# EasyEDA schematic schematic.json
TITLE: Sheet_1; REV: 1.0; Date: 2024-11-02; Sheet: 1/1; Drawn By: swayamsa01; Company: Your Company
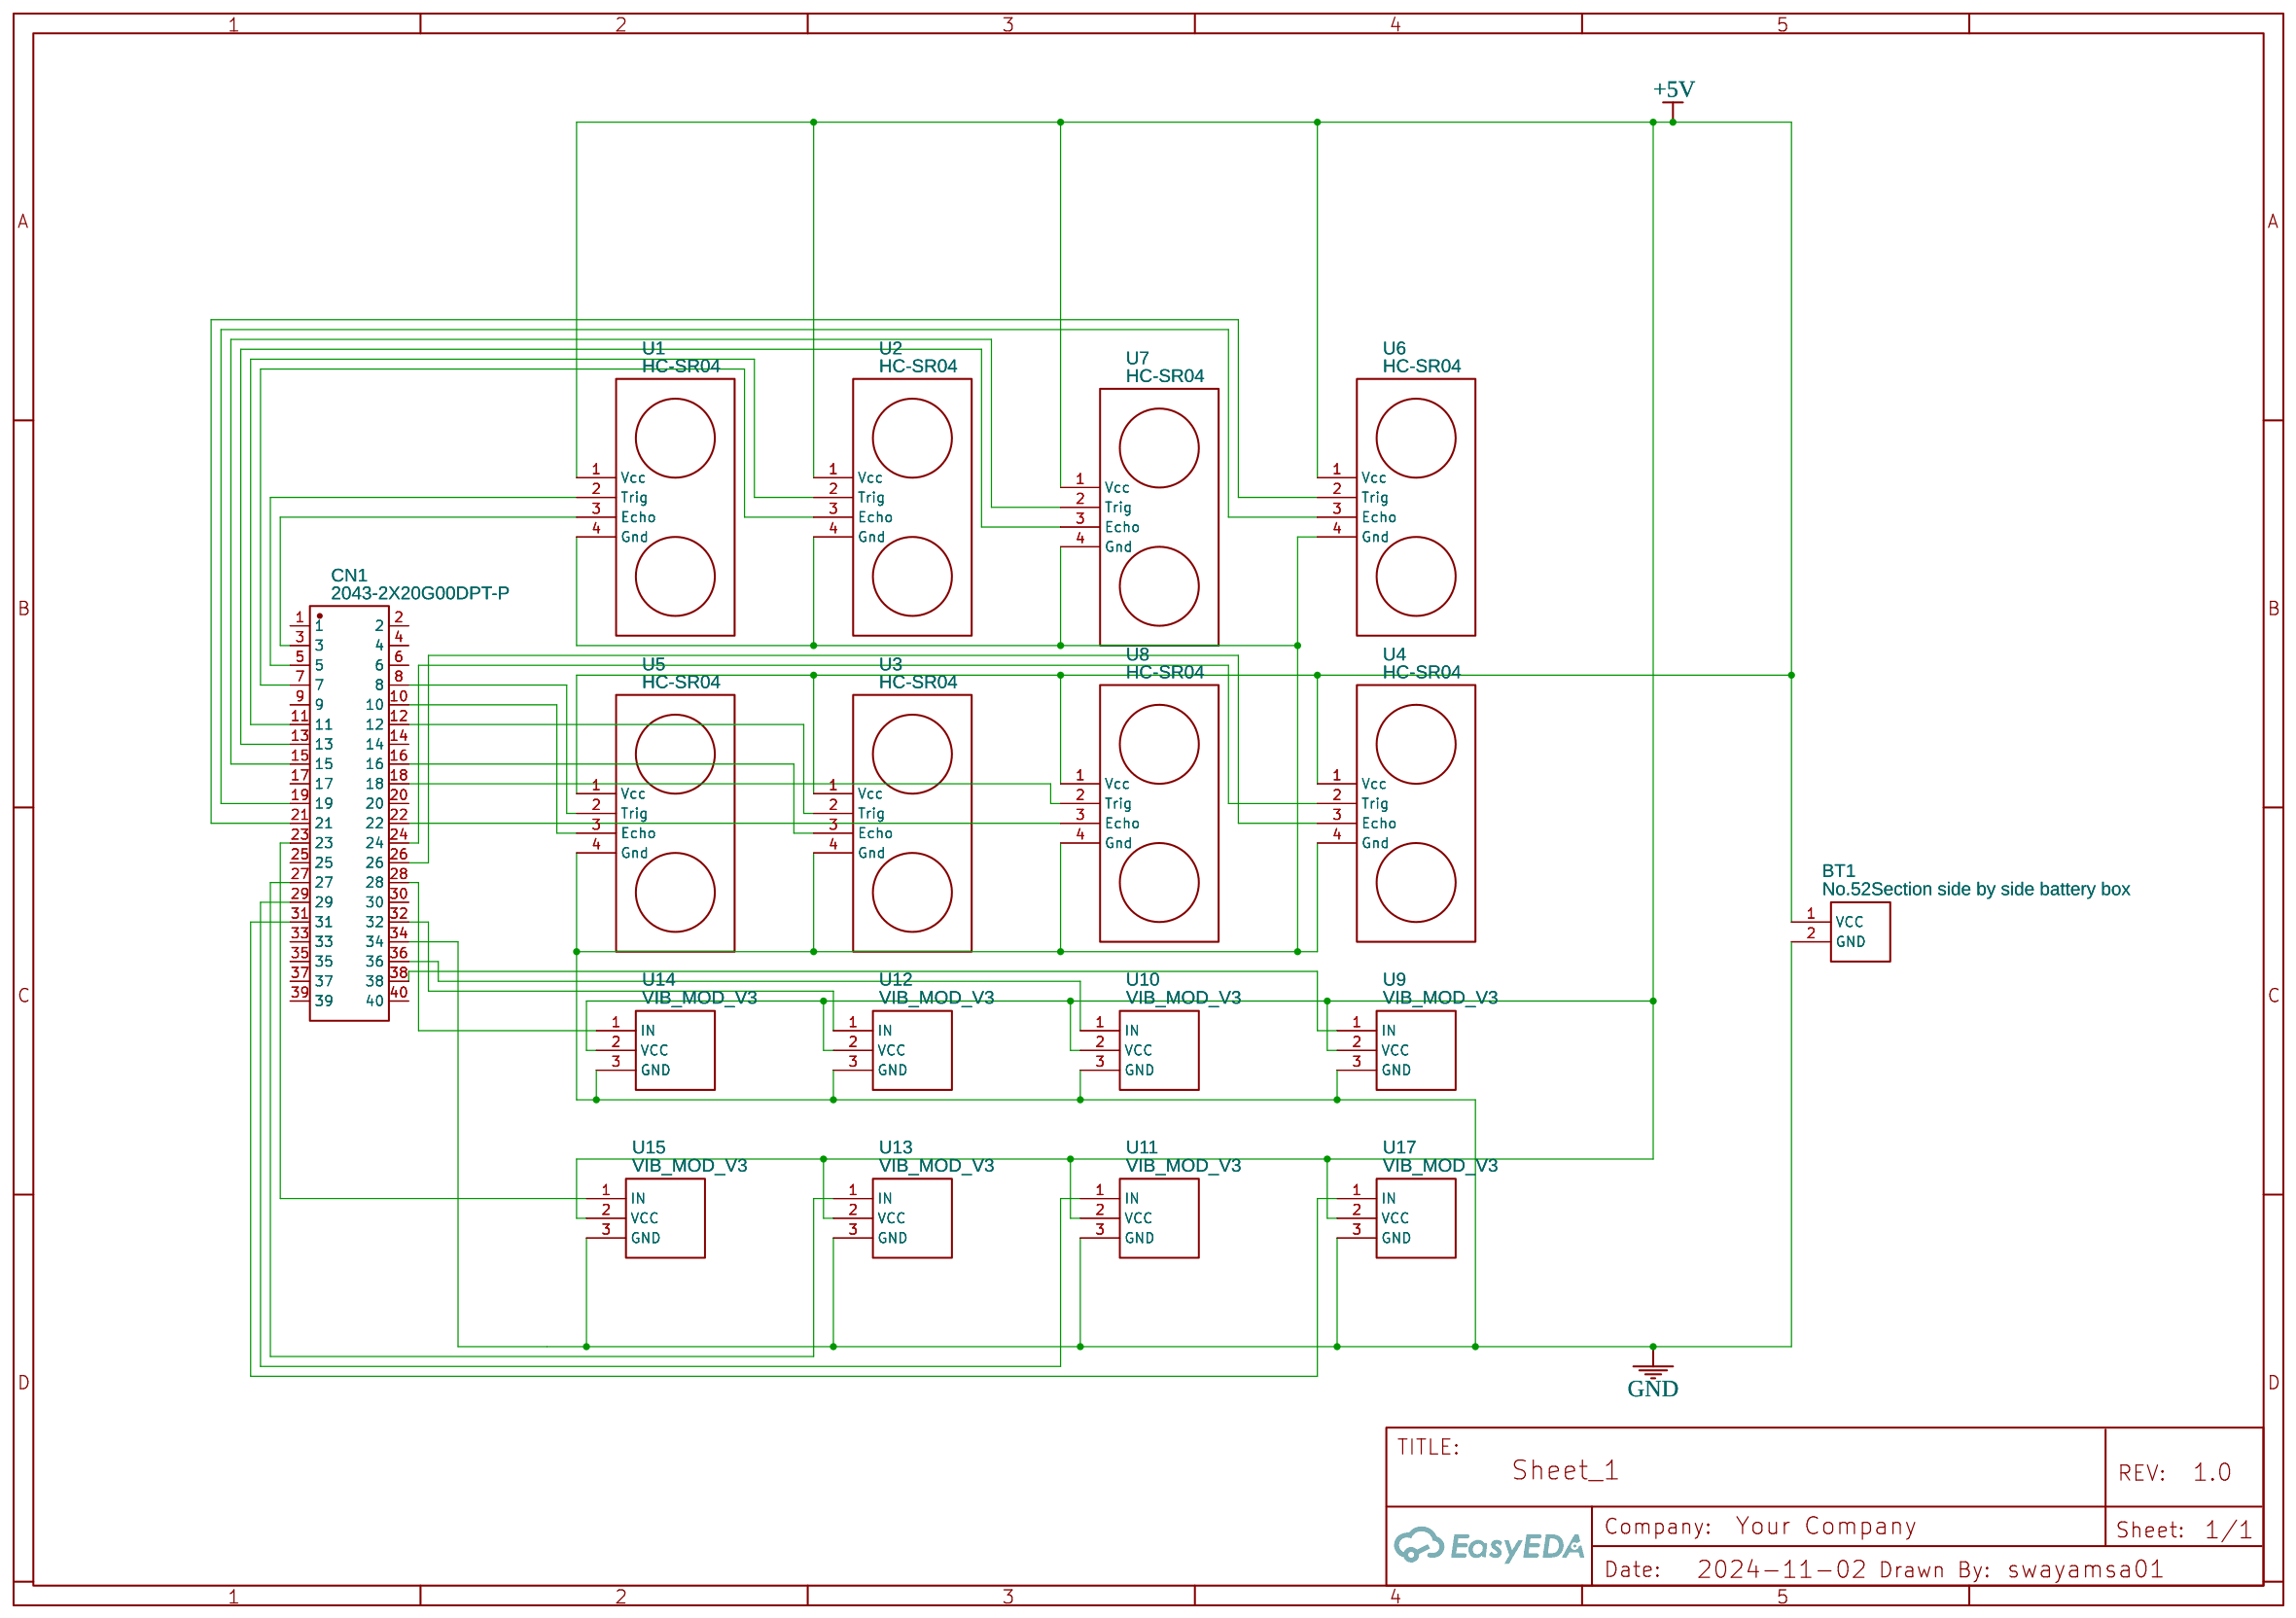
[diagram p0: schematic sheet]

## Parts
BT1  No.52Section side by side battery box  [BAT-TH_BC2AA]
CN1  2043-2X20G00DPT-P  [HDR-SMD_40P-P2.54-V-F-R2-C20-S6.6-EH]
U1  HC-SR04  [HCSR04]
U2  HC-SR04  [HCSR04]
U3  HC-SR04  [HCSR04]
U4  HC-SR04  [HCSR04]
U5  HC-SR04  [HCSR04]
U6  HC-SR04  [HCSR04]
U7  HC-SR04  [HCSR04]
U8  HC-SR04  [HCSR04]
U9  VIB_MOD_V3  [VB_MOTOR_V3_FT_V1]
U10  VIB_MOD_V3  [VB_MOTOR_V3_FT_V1]
U11  VIB_MOD_V3  [VB_MOTOR_V3_FT_V1]
U12  VIB_MOD_V3  [VB_MOTOR_V3_FT_V1]
U13  VIB_MOD_V3  [VB_MOTOR_V3_FT_V1]
U14  VIB_MOD_V3  [VB_MOTOR_V3_FT_V1]
U15  VIB_MOD_V3  [VB_MOTOR_V3_FT_V1]
U17  VIB_MOD_V3  [VB_MOTOR_V3_FT_V1]

## Library data of the parts
BT1 = No.52Section side by side battery box: Supplier: LCSC; Manufacturer: 国产; Manufacturer Part: 五号2节并列电池盒; Supplier Part: C5404; JLCPCB Part Class: Extended Part
CN1 = 2043-2X20G00DPT-P: Contributor: lcsc; Supplier: LCSC; Supplier Part: C9900015302; Manufacturer: null; JLCPCB Part Class: Extended Part
U1-U8 = HC-SR04: Contributor: torpill40
U9-U15 U17 = VIB_MOD_V3: Contributor: swayamsa01; Package Display: No

## Nets
+5V: BT1.1(VCC) U1.1(Vcc) U2.1(Vcc) U3.1(Vcc) U4.1(Vcc) U5.1(Vcc) U6.1(Vcc) U7.1(Vcc) U8.1(Vcc) U9.2(VCC) U10.2(VCC) U11.2(VCC) U12.2(VCC) U13.2(VCC) U14.2(VCC) U15.2(VCC) U17.2(VCC)
GND: BT1.2(GND) CN1.34 U1.4(Gnd) U2.4(Gnd) U3.4(Gnd) U4.4(Gnd) U5.4(Gnd) U6.4(Gnd) U7.4(Gnd) U8.4(Gnd) U9.3(GND) U10.3(GND) U11.3(GND) U12.3(GND) U13.3(GND) U14.3(GND) U15.3(GND) U17.3(GND)
Net-(CN1-3): CN1.3 U1.3(Echo)
Net-(CN1-5): CN1.5 U1.2(Trig)
Net-(CN1-7): CN1.7 U2.3(Echo)
Net-(CN1-8): CN1.8 U5.2(Trig)
Net-(CN1-10): CN1.10 U5.3(Echo)
Net-(CN1-11): CN1.11 U2.2(Trig)
Net-(CN1-12): CN1.12 U3.2(Trig)
Net-(CN1-13): CN1.13 U7.3(Echo)
Net-(CN1-15): CN1.15 U7.2(Trig)
Net-(CN1-16): CN1.16 U3.3(Echo)
Net-(CN1-18): CN1.18 U8.2(Trig)
Net-(CN1-19): CN1.19 U6.3(Echo)
Net-(CN1-21): CN1.21 U6.2(Trig)
Net-(CN1-22): CN1.22 U8.3(Echo)
Net-(CN1-23): CN1.23 U15.1(IN)
Net-(CN1-24): CN1.24 U4.2(Trig)
Net-(CN1-26): CN1.26 U4.3(Echo)
Net-(CN1-27): CN1.27 U13.1(IN)
Net-(CN1-28): CN1.28 U14.1(IN)
Net-(CN1-29): CN1.29 U11.1(IN)
Net-(CN1-31): CN1.31 U17.1(IN)
Net-(CN1-32): CN1.32 U12.1(IN)
Net-(CN1-36): CN1.36 U10.1(IN)
Net-(CN1-38): CN1.38 U9.1(IN)

Not connected (* = marked no-connect by the designer): CN1 1 2 4 6 9 14 17 20 25 30 33 35 37 39 40
